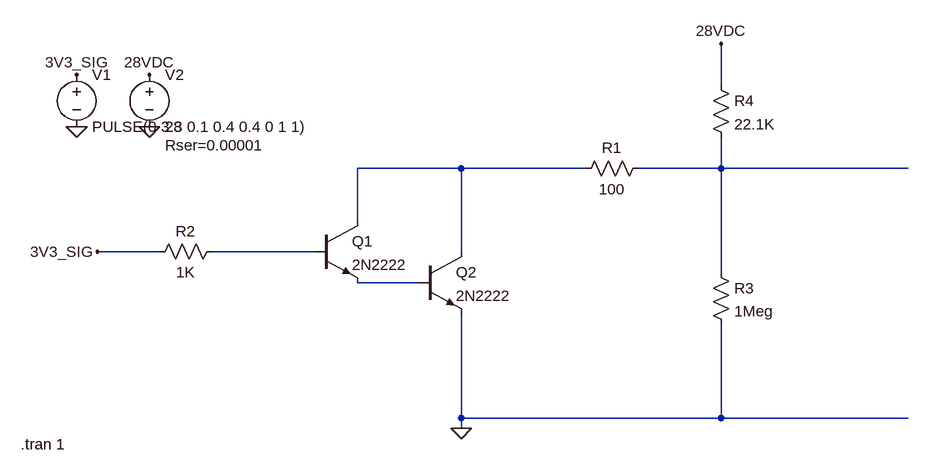
[diagram p0: schematic DarlingtonTest.asc]
DarlingtonTest.asc, the LTspice schematic file:
Version 4
SHEET 1 1380 680
WIRE 1088 32 1088 -32
WIRE 688 160 528 160
WIRE 880 160 688 160
WIRE 1088 160 1088 112
WIRE 1088 160 960 160
WIRE 1376 160 1088 160
WIRE 528 240 528 160
WIRE 224 288 128 288
WIRE 464 288 304 288
WIRE 688 288 688 160
WIRE 1088 320 1088 160
WIRE 624 336 528 336
WIRE 688 544 688 384
WIRE 1088 544 1088 400
WIRE 1088 544 688 544
WIRE 1376 544 1088 544
WIRE 688 560 688 544
FLAG 688 560 0
FLAG 1088 -32 28VDC
FLAG 128 288 3V3_SIG
FLAG 96 96 0
FLAG 208 96 0
FLAG 208 16 28VDC
FLAG 96 16 3V3_SIG
SYMBOL res 976 144 R90
WINDOW 0 0 56 VBottom 2
WINDOW 3 32 56 VTop 2
SYMATTR InstName R1
SYMATTR Value 100
SYMATTR SpiceLine tol=1 pwr=0.1
SYMBOL res 320 272 R90
WINDOW 0 0 56 VBottom 2
WINDOW 3 32 56 VTop 2
SYMATTR InstName R2
SYMATTR Value 1K
SYMATTR SpiceLine tol=1 pwr=0.1
SYMBOL npn 464 240 R0
SYMATTR InstName Q1
SYMATTR Value 2N2222
SYMBOL npn 624 288 R0
SYMATTR InstName Q2
SYMATTR Value 2N2222
SYMBOL res 1072 304 R0
SYMATTR InstName R3
SYMATTR Value 1Meg
SYMATTR SpiceLine tol=1 pwr=0.1
SYMBOL voltage 96 0 R0
WINDOW 123 0 0 Left 0
WINDOW 39 0 0 Left 0
SYMATTR InstName V1
SYMATTR Value PULSE(0 3.3 0.1 0.4 0.4 0 1 1)
SYMBOL voltage 208 0 R0
WINDOW 123 0 0 Left 0
WINDOW 39 24 124 Left 2
SYMATTR InstName V2
SYMATTR Value 28
SYMATTR SpiceLine Rser=0.00001
SYMBOL res 1072 16 R0
SYMATTR InstName R4
SYMATTR Value 22.1K
SYMATTR SpiceLine tol=1 pwr=0.1
TEXT 10 584 Left 2 !.tran 1

The netlist it stands for:
* DarlingtonTest.asc
R1 N002 N001 100 tol=1 pwr=0.1
R2 N003 3V3_SIG 1K tol=1 pwr=0.1
Q1 N001 N003 N004 0 2N2222
Q2 N001 N004 0 0 2N2222
R3 N002 0 1Meg tol=1 pwr=0.1
V1 3V3_SIG 0 PULSE(0 3.3 0.1 0.4 0.4 0 1 1)
V2 28VDC 0 28 Rser=0.00001
R4 28VDC N002 22.1K tol=1 pwr=0.1
.model NPN NPN
.model PNP PNP
.lib standard.bjt
.tran 1
.backanno
.end